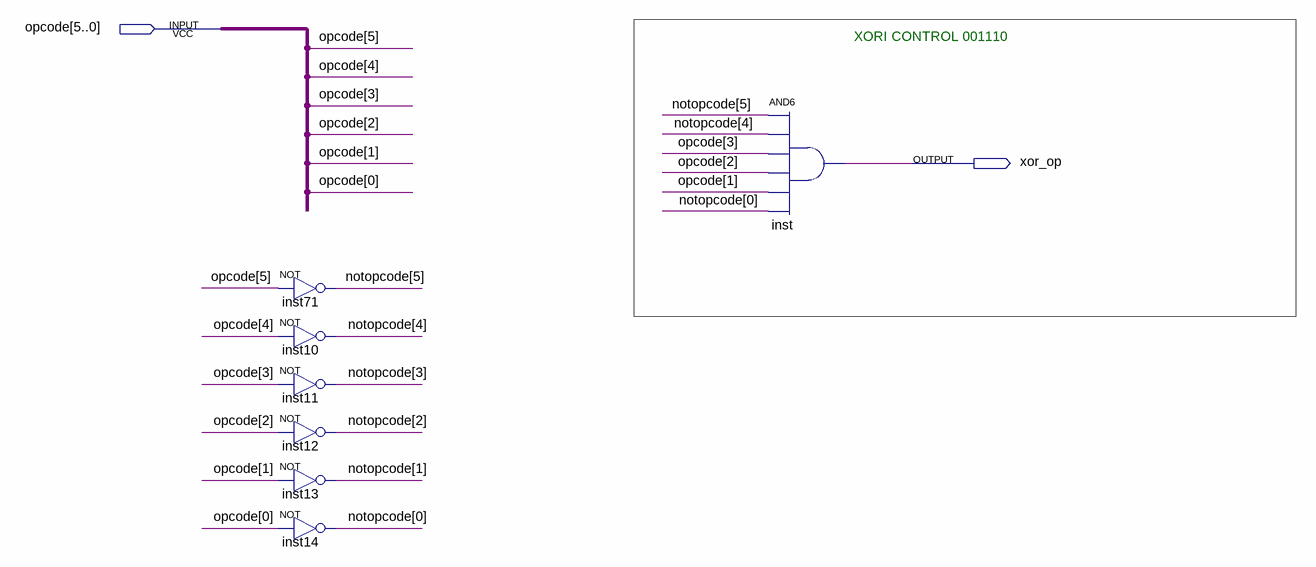
[diagram p0: schematic sheet]
// Quartus schematic Xori_func.bdf as structural Verilog: 7 symbols, 2 pins
module Xori_func (
  input  [5:0] opcode,
  output xor_op
);

  wire [5:0] notopcode;

  not inst71 (notopcode[5], opcode[5]);
  not inst10 (notopcode[4], opcode[4]);
  not inst11 (notopcode[3], opcode[3]);
  not inst12 (notopcode[2], opcode[2]);
  not inst13 (notopcode[1], opcode[1]);
  not inst14 (notopcode[0], opcode[0]);
  and inst (xor_op, notopcode[5], notopcode[4], opcode[3], opcode[2], opcode[1], notopcode[0]);

  // Notes on the sheet:
  //   XORI CONTROL 001110
endmodule
